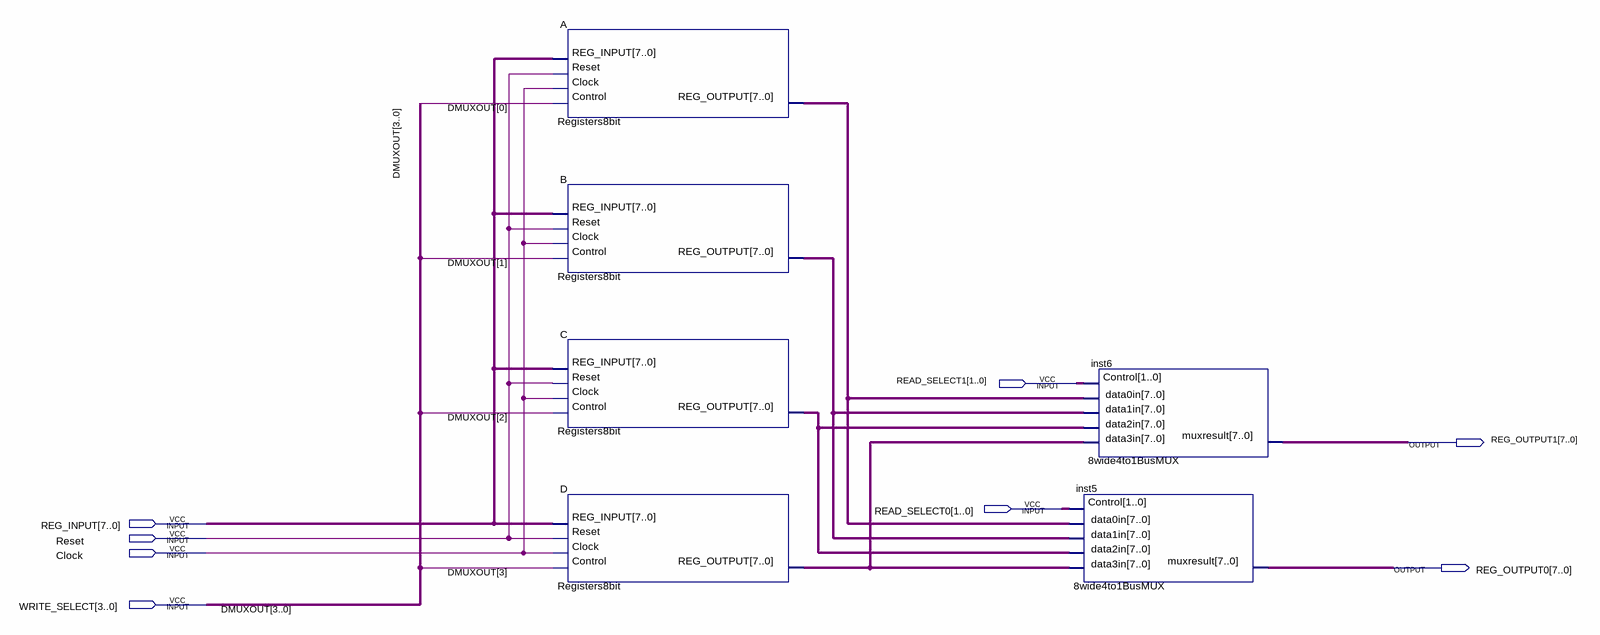
[diagram p0: schematic sheet]
// Quartus schematic 4x8BitRegister.bdf as structural Verilog: 6 symbols, 8 pins
module \4x8BitRegister  (
  input  [1:0] READ_SELECT1,
  input  [1:0] READ_SELECT0,
  input  [7:0] REG_INPUT,
  input  Reset,
  input  Clock,
  input  [3:0] WRITE_SELECT,
  output [7:0] REG_OUTPUT1,
  output [7:0] REG_OUTPUT0
);

  wire [7:0] A_reg_output, B_reg_output, C_reg_output, D_reg_output;

  Registers8bit A (
    .Control(WRITE_SELECT[0]), .Clock(Clock), .Reset(Reset), .REG_INPUT(REG_INPUT), .REG_OUTPUT(A_reg_output));
  Registers8bit B (
    .Control(WRITE_SELECT[1]), .Clock(Clock), .Reset(Reset), .REG_INPUT(REG_INPUT), .REG_OUTPUT(B_reg_output));
  Registers8bit C (
    .Control(WRITE_SELECT[2]), .Clock(Clock), .Reset(Reset), .REG_INPUT(REG_INPUT), .REG_OUTPUT(C_reg_output));
  Registers8bit D (
    .Control(WRITE_SELECT[3]), .Clock(Clock), .Reset(Reset), .REG_INPUT(REG_INPUT), .REG_OUTPUT(D_reg_output));
  \8wide4to1BusMUX  inst5 (
    .data0in(A_reg_output), .data1in(B_reg_output), .data2in(C_reg_output), .data3in(D_reg_output),
    .Control(READ_SELECT0), .muxresult(REG_OUTPUT0));
  \8wide4to1BusMUX  inst6 (
    .data0in(A_reg_output), .data1in(B_reg_output), .data2in(C_reg_output), .data3in(D_reg_output),
    .Control(READ_SELECT1), .muxresult(REG_OUTPUT1));

  // Other names for the same wires on the sheet: DMUXOUT[3:0] = WRITE_SELECT
endmodule
